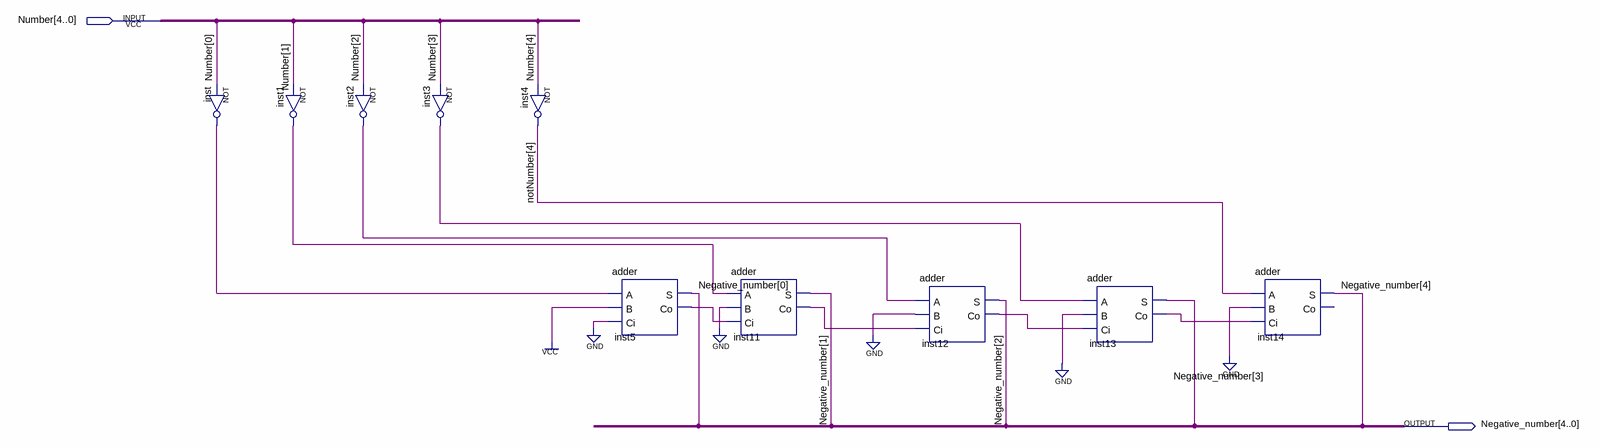
[diagram p0: schematic sheet]
// Quartus schematic C2.bdf as structural Verilog: 10 symbols, 2 pins
module C2 (
  input  [4:0] Number,
  output [4:0] Negative_number
);

  wire inst1_out, inst2_out, inst3_out, inst5_co, inst11_co, inst12_co, inst13_co, inst_out;
  wire [4:4] notNumber;

  not inst (inst_out, Number[0]);
  not inst1 (inst1_out, Number[1]);
  not inst2 (inst2_out, Number[2]);
  not inst3 (inst3_out, Number[3]);
  not inst4 (notNumber[4], Number[4]);
  adder inst5 (.A(inst_out), .B(1'b1), .Ci(1'b0), .S(Negative_number[0]), .Co(inst5_co));
  adder inst11 (.A(inst1_out), .B(1'b0), .Ci(inst5_co), .S(Negative_number[1]), .Co(inst11_co));
  adder inst12 (.A(inst2_out), .B(1'b0), .Ci(inst11_co), .S(Negative_number[2]), .Co(inst12_co));
  adder inst13 (.A(inst3_out), .B(1'b0), .Ci(inst12_co), .S(Negative_number[3]), .Co(inst13_co));
  adder inst14 (.A(notNumber[4]), .B(1'b0), .Ci(inst13_co), .S(Negative_number[4]));  // open: Co
endmodule
